# EAGLE schematic Collision Logic (EAGLE 7.2.0)
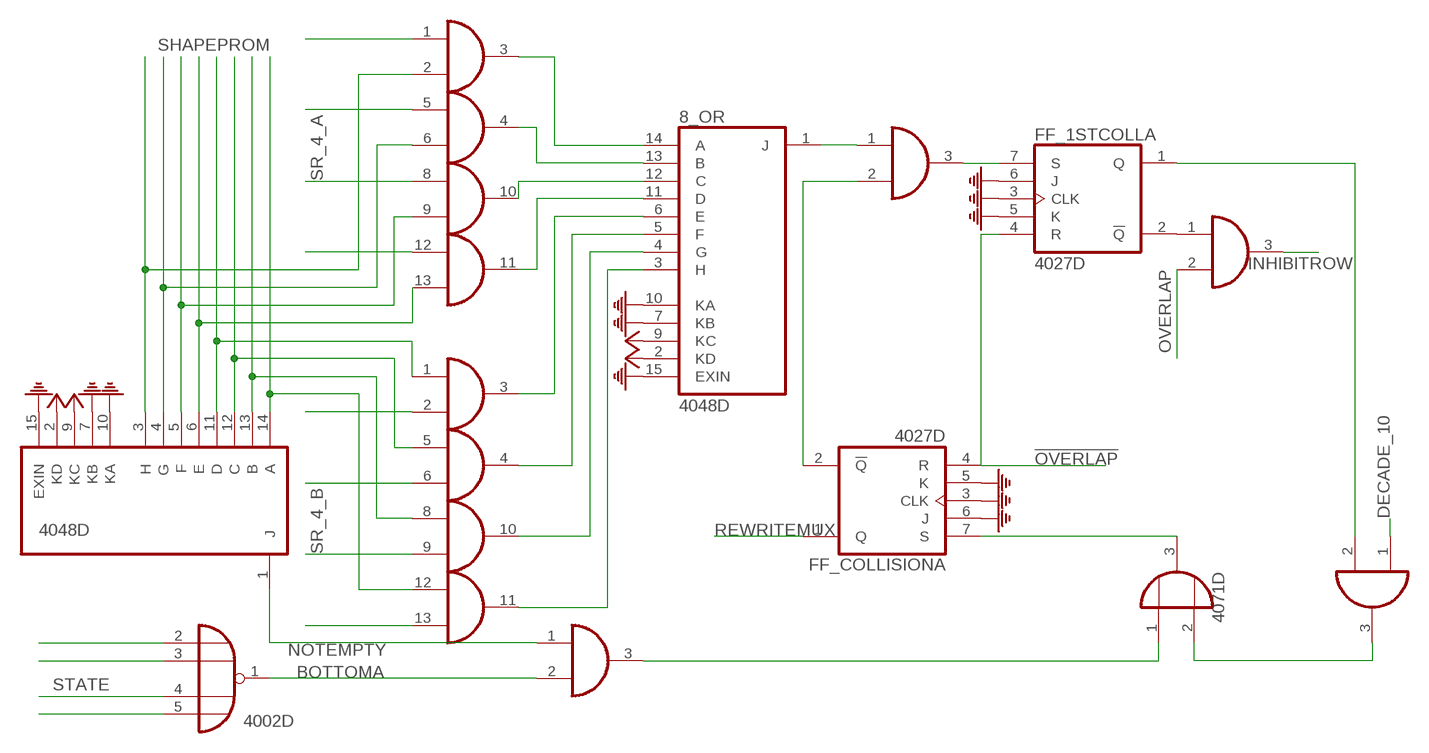
[diagram p0: schematic, sheet 1]

## Parts
8_OR  4048D  [SO16]
BOTTOM  4002D  [SO14]
FF_1STCOLL  4027D  [SO16]
FF_COLLISION  4027D  [SO16]
IC1  4081D  [SO14]
IC2  4081D  [SO14]
IC3  4081D  [SO14]
IC4  4081D  [SO14]
IC5  4081D  [SO14]
IC8  4081D  [SO14]
IC9  4071D  [SO14]
NOTEMPTY  4048D  [SO16]

## Nets
!OVERLAP: FF_1STCOLL.4(A:R) FF_COLLISION.4(A:R)
DECADE_10: IC3.1(A:I0)
INHIBITROW: IC5.3(A:O)
N$1: IC1.1(A:I0)
N$2: 8_OR.1(J) IC4.1(A:I0)
N$3: IC1.8(C:I0)
N$4: IC1.12(D:I0)
N$5: BOTTOM.2(A:I0) BOTTOM.3(A:I1) BOTTOM.4(A:I2)
N$6: IC2.2(A:I1)
N$7: IC8.1(A:I0) NOTEMPTY.1(J)
N$8: IC2.9(C:I1)
N$9: IC2.13(D:I1)
N$10: FF_1STCOLL.7(A:S) IC4.3(A:O)
N$11: FF_COLLISION.2(A:!Q) IC4.2(A:I1)
N$12: 8_OR.14(A) IC1.3(A:O)
N$13: 8_OR.13(B) IC1.4(B:O)
N$14: BOTTOM.1(A:O) IC8.2(A:I1)
N$15: 8_OR.12(C) IC1.10(C:O)
N$16: IC3.3(A:O) IC9.2(A:I1)
N$17: 8_OR.11(D) IC1.11(D:O)
N$18: 8_OR.3(H) IC2.11(D:O)
N$19: 8_OR.4(G) IC2.10(C:O)
N$20: 8_OR.5(F) IC2.4(B:O)
N$21: 8_OR.6(E) IC2.3(A:O)
N$22: FF_1STCOLL.1(A:Q) IC3.2(A:I1)
N$23: IC8.3(A:O) IC9.1(A:I0)
N$24: FF_COLLISION.7(A:S) IC9.3(A:O)
N$26: FF_1STCOLL.2(A:!Q) IC5.1(A:I0)
N$29: IC2.1(A:I0) NOTEMPTY.11(D)
N$30: IC1.2(A:I1) NOTEMPTY.3(H)
N$31: IC1.9(C:I1) NOTEMPTY.5(F)
N$32: IC2.8(C:I0) NOTEMPTY.13(B)
N$33: IC2.12(D:I0) NOTEMPTY.14(A)
N$34: IC2.5(B:I0) NOTEMPTY.12(C)
N$35: IC1.13(D:I1) NOTEMPTY.6(E)
OVERLAP: IC5.2(A:I1)
PE: 8_OR.7(KB) 8_OR.10(KA) 8_OR.15(EXIN) FF_1STCOLL.3(A:CLK) FF_1STCOLL.5(A:K) FF_1STCOLL.6(A:J) FF_COLLISION.3(A:CLK) FF_COLLISION.5(A:K) FF_COLLISION.6(A:J) NOTEMPTY.7(KB) NOTEMPTY.10(KA) NOTEMPTY.15(EXIN)
REWRITEMUX: FF_COLLISION.1(A:Q)
SHAPEPROM: IC1.6(B:I1) NOTEMPTY.4(G)
SR_4_A: IC1.5(B:I0)
SR_4_B: IC2.6(B:I1)
STATE: BOTTOM.5(A:I3)
V+: 8_OR.2(KD) 8_OR.9(KC) NOTEMPTY.2(KD) NOTEMPTY.9(KC)
Unconnected: BOTTOM.9(B:I0) BOTTOM.10(B:I1) BOTTOM.11(B:I2) BOTTOM.12(B:I3) BOTTOM.13(B:O) FF_1STCOLL.9(B:S) FF_1STCOLL.10(B:J) FF_1STCOLL.11(B:K) FF_1STCOLL.12(B:R) FF_1STCOLL.13(B:CLK) FF_1STCOLL.14(B:!Q) FF_1STCOLL.15(B:Q) FF_COLLISION.9(B:S) FF_COLLISION.10(B:J) FF_COLLISION.11(B:K) FF_COLLISION.12(B:R) FF_COLLISION.13(B:CLK) FF_COLLISION.14(B:!Q) FF_COLLISION.15(B:Q) IC3.4(B:O) IC3.5(B:I0) IC3.6(B:I1) IC3.8(C:I0) IC3.9(C:I1) IC3.10(C:O) IC3.11(D:O) IC3.12(D:I0) IC3.13(D:I1) IC4.4(B:O) IC4.5(B:I0) IC4.6(B:I1) IC4.8(C:I0) IC4.9(C:I1) IC4.10(C:O) IC4.11(D:O) IC4.12(D:I0) IC4.13(D:I1) IC5.4(B:O) IC5.5(B:I0) IC5.6(B:I1) IC5.8(C:I0) IC5.9(C:I1) IC5.10(C:O) IC5.11(D:O) IC5.12(D:I0) IC5.13(D:I1) IC8.4(B:O) IC8.5(B:I0) IC8.6(B:I1) IC8.8(C:I0) IC8.9(C:I1) IC8.10(C:O) IC8.11(D:O) IC8.12(D:I0) IC8.13(D:I1) IC9.4(B:O) IC9.5(B:I0) IC9.6(B:I1) IC9.8(C:I0) IC9.9(C:I1) IC9.10(C:O) IC9.11(D:O) IC9.12(D:I0) IC9.13(D:I1)

## Power pins joined to a net without a drawn wire
VDD: 8_OR.16(VDD) BOTTOM.14(P:VDD) FF_1STCOLL.16(P:VDD) FF_COLLISION.16(P:VDD) IC1.14(P:VDD) IC2.14(P:VDD) IC3.14(P:VDD) IC4.14(P:VDD) IC5.14(P:VDD) IC8.14(P:VDD) IC9.14(P:VDD) NOTEMPTY.16(VDD)
VSS: 8_OR.8(VSS) BOTTOM.7(P:VSS) FF_1STCOLL.8(P:VSS) FF_COLLISION.8(P:VSS) IC1.7(P:VSS) IC2.7(P:VSS) IC3.7(P:VSS) IC4.7(P:VSS) IC5.7(P:VSS) IC8.7(P:VSS) IC9.7(P:VSS) NOTEMPTY.8(VSS)

## Library data of the parts
8_OR NOTEMPTY = 40xx:4048: Expandable 8-input GATE
BOTTOM = 40xx:4002: 4-input NOR
FF_1STCOLL FF_COLLISION = 40xx:4027: Dual JK FLIP FLOP
IC1-IC5 IC8 = 40xx:4081: Quad 2-input AND
IC9 = 40xx:4071: Quad 2-input OR